# EAGLE design LT8335_6V (EAGLE 8.3.2)
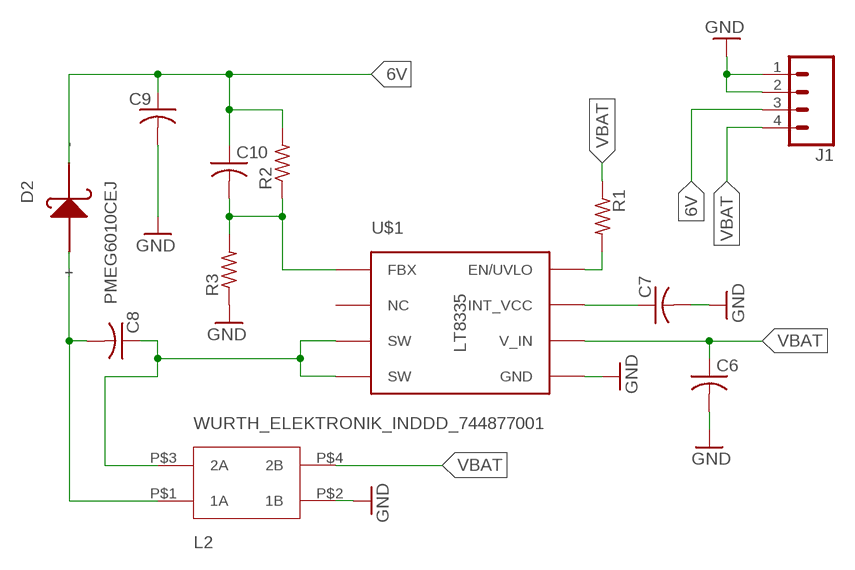
[diagram p0: schematic, sheet 1]

## Parts
C6  C-USC0805  [C0805]
C7  C-USC0805  [C0805]
C8  C-USC0805  [C0805]
C9  C-USC0805  [C0805]
C10  C-USC0805  [C0805]
D2  PMEG6010CEJ  [SC-90]
J1  CONN_04LOCK  [1X04_LOCK]
L2  WURTH_ELEKTRONIK_INDDD_744877001  [WURTH_ELEKTRONIK_INDDD_744877001]
R1  R-US_R0805  [R0805]
R2  R-US_R0805  [R0805]
R3  R-US_R0805  [R0805]
U$1  LT8335  [DDB]

## Nets
6V: C9.1 C10.1 D2.P$2(-) J1.3 R2.2
EN_UVLO1: R1.2 U$1.P$8(EN/UVLO)
FBX1: C10.2 R2.1 R3.2 U$1.P$1(FBX)
GND: C6.2 C7.2 C9.2 J1.1 J1.2 L2.P$2(1B) R3.1 U$1.GND U$1.P$5(GND)
INT_VCC1: C7.1 U$1.P$7(INT_VCC)
N$1: C8.2 D2.P$1(+) L2.P$1(1A)
SW1: C8.1 L2.P$3(2A) U$1.P$3(SW) U$1.P$4(SW)
VBAT: C6.1 J1.4 L2.P$4(2B) R1.1 U$1.P$6(V_IN)
Unconnected: U$1.P$2(NC)

## Library data of the parts
C6-C10 = rcl:C-US: CAPACITOR, American symbol
D2 = DubSat1 Components:PMEG6010CEJ
J1 = SparkFun-Connectors:CONN_04: Multi connection point. Often used as Generic Header-pin footprint for 0.1 inch spaced/style header connections On any of the 0.1 inch spaced packages, you can populate with these: Break Away Headers - Straight <https://www.sparkfun.com/products/116> (PRT-00116) Break Away Male Headers - Right Angle <https://www.sparkfun.com/products/553> (PRT-00553) Female Headers <https://www.sparkfun.com/products/115> (PRT-00115) Break Away Headers - Machine Pin <https://www.sparkfun.com/products/117> (PRT-00117) Break Away Female Headers - Swiss Machine Pin <https://www.sparkfun.com/products/743> (PRT-00743) For SCREWTERMINALS and SPRING TERMINALS visit here: Screw Terimnals on SparkFun.com <https://www.sparkfun.com/search/results?term=Screw+Terminals> (5mm/3.5mm/2.54mm spacing) This device is also useful as a general connection point to wire up your design to another part of your project. Our various solder wires solder well into these plated through hole pads. Hook-Up Wire - Assortment (Stranded, 22 AWG) <https://www.sparkfun.com/products/11375> (PRT-11375) Hook-Up Wire - Assortment (Solid Core, 22 AWG) <https://www.sparkfun.com/products/11367> (PRT-11367) View the entire wire category on our website here <https://www.sparkfun.com/categories/141> Special notes: Molex polarized connector foot print use with SKU : PRT-08231 with associated crimp pins and housings. 1MM SMD Version SKU: PRT-10208; PROD_ID: CONN-09696
L2 = DubSat1 Components:WURTH_ELEKTRONIK_INDDD_744877001
R1-R3 = rcl:R-US_: RESISTOR, American symbol
U$1 = DubSat1 Components:LT8335

## Net classes
0 default: width 0.254 mm, drill 0.254 mm, clearance 0.152 mm

## Board
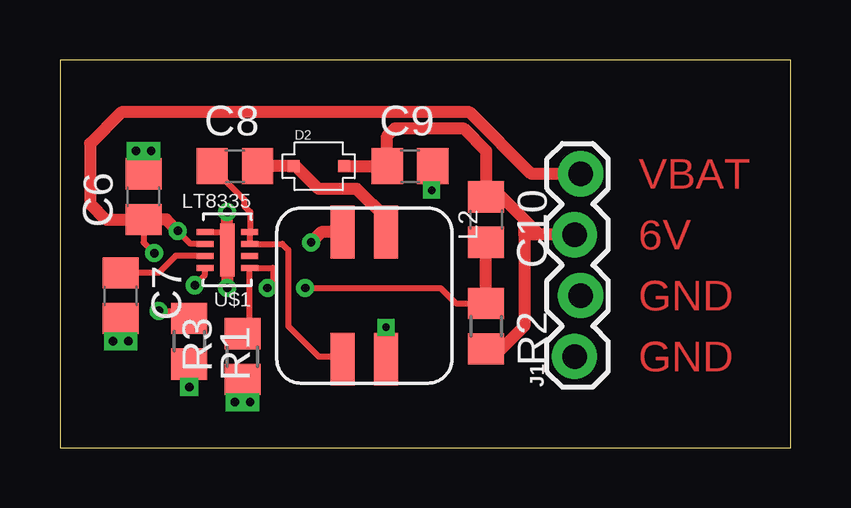
[diagram p1: board, top side]
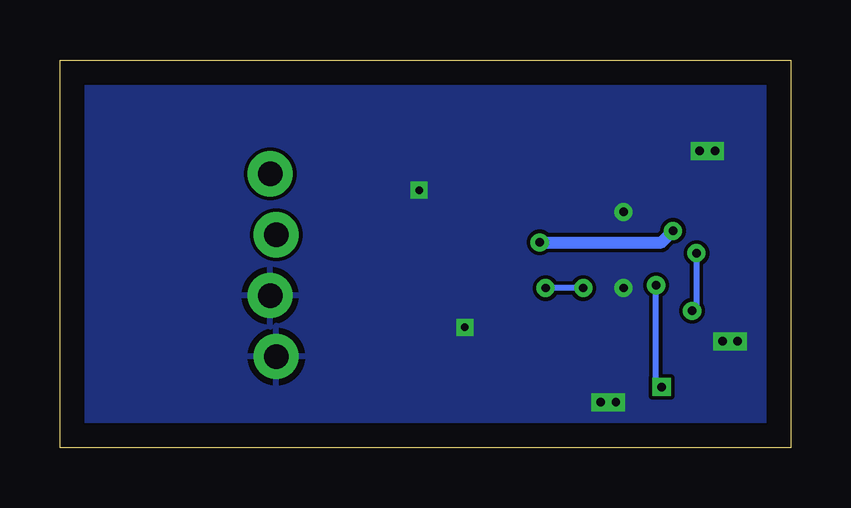
[diagram p2: board, bottom side, seen from below]

Size 30.47 x 16.18 mm. Coordinates in mm from the lower left corner, seen from the top.
Outline: 30.47,0 30.47,16.18 0,16.18 0,0 30.47,0
Copper layers (1*16): Top 0.035mm / dielectric 1.5mm / Bottom 0.035mm
Design rules "default": minimum track width 6mil, minimum drill 0.35mm, track to track 6mil, track to pad 6mil, pad to pad 6mil, via to via 6mil, smd to smd 6mil, copper to edge 40mil, drill to drill 6mil, minimum pad ring 10mil, minimum via ring 8mil, stop-mask expansion 4mil, vias tented up to drill 0mil, thermal gap 10mil

### Footprints (pad centres in the part's own frame; a part is rotated, then mirrored left to right if it is on the bottom)
C0805 = smd 1.3 x 1.5: 1 -0.95,0; 2 0.95,0
SC-90 = smd 0.5 x 0.5: P$1 -1.05,0; P$2 1.05,0
1X04_LOCK = drill 1.016 pad 1.88: 1 0,0.127; 2 2.54,-0.127; 3 5.08,0.127; 4 7.62,-0.127
WURTH_ELEKTRONIK_INDDD_744877001 = smd 1 x 2.2: P$1 -0.9,-2.65; P$2 -0.9,2.65; P$3 0.9,2.65; P$4 0.9,-2.65
R0805 = smd 1.3 x 1.5: 1 -0.95,0; 2 0.95,0
DDB = smd 0.61 x 2.2: GND 0,0 | smd 0.7 x 0.25: P$1 -0.925,0.75; P$2 -0.925,0.25; P$3 -0.925,-0.25; P$4 -0.925,-0.75; P$5 0.925,-0.75; P$6 0.925,-0.25; P$7 0.925,0.25; P$8 0.925,0.75

### Placement (x,y rotation side)
C6  3.48,10.48 90 top
C7  2.53,6.35 270 top
C8  7.29,11.75 0 top
C9  14.6,11.75 0 top
C10  17.77,9.53 270 top
D2  10.79,11.75 0 top
J1  21.58,3.81 90 top
L2  12.69,6.35 180 top
R1  5.39,4.45 270 top
R2  17.77,5.08 270 top
R3  7.61,3.81 90 top
U$1  6.98,8.25 180 top

### Tracks (layer width: path | path; a pad name or v marks a point on that pad's centre or on a via)
6V
  Top 0.508: D2.P$2 C9.1 13.65,13.02 13.96,13.34 16.82,13.34 17.77,12.38 C10.1 18.41,10.47 19.36,9.53 | 19.36,8.89 19.36,9.53 | 19.36,8.89 19.36,5.08 18.41,4.13 R2.2 | J1.3 20.31,8.89 19.99,8.89 | 19.99,8.89 19.36,9.53 | 19.99,8.89 19.36,8.89
EN_UVLO1  (via drill 0.35)
  Top 0.254: R1.2 v5.39,2.54 | v5.62,6.78 6.05,7.22 U$1.P$8
  Bottom 0.254: v5.39,2.54 5.62,2.77 v5.62,6.78
FBX1  (via drill 0.35)
  Top 0.254: R3.2 7.9,5.05 U$1.P$1 8.88,7.5 8.88,6.9 v8.65,6.67 | v10.22,6.67 15.87,6.67 16.5,6.03 R2.1
  Top 0.508: C10.2 R2.1
  Bottom 0.254: v8.65,6.67 v10.22,6.67
GND  (via drill 0.3, 0.35)
  Top 0.254: U$1.P$5 6.86,9 6.98,8.89 U$1.GND | L2.P$2 v13.59,5.03 | v7.29,1.91 7.61,2.22 | v7.93,1.91 7.61,2.22 | 7.61,2.22 R3.1 | v3.17,12.38 3.17,11.75 C6.2 3.8,11.75 v3.8,12.38 | v2.85,4.45 2.85,5.08 2.69,5.24 | 2.69,5.24 C7.2 | v2.21,4.45 2.21,4.76 2.69,5.24
  Top 0.508: v6.98,6.67 U$1.GND v6.98,9.84 | v15.5,10.74 15.5,11.7 C9.2
  pour Bottom: -0.01,0 -0.01,16.51 30.47,16.51 30.47,0
INT_VCC1
  Top 0.254: U$1.P$7 4.82,8 4.12,7.3 C7.1
N$1
  Top 0.508: C8.2 D2.P$1 9.83,11.75 10.79,10.8 12.37,10.8 13.59,9.58 L2.P$1
SW1
  Top 0.254: L2.P$3 11.68,3.81 10.79,3.81 9.52,5.08 9.52,8.25 9.27,8.5 U$1.P$3 U$1.P$4 7.93,9.03 7.93,9.84 7.68,10.09 7.68,10.36 6.34,11.7 C8.1
VBAT  (via drill 0.35)
  Top 0.254: U$1.P$6 5.46,8.5 v4.91,9.05 | R1.1 5.39,5.71 | R1.1 | C6.1 3.48,8.57 v3.93,8.12 | v4.12,5.71 5.07,5.71 R1.1
  Top 0.508: v4.91,9.05 4.43,9.53 C6.1 1.89,9.53 1.26,10.16 1.26,12.7 2.55,14 17.09,14 19.66,11.43 J1.4 | L2.P$4 10.9,9 v10.47,8.57
  Bottom 0.254: v3.93,8.12 3.93,5.9 v4.12,5.71
  Bottom 0.508: v10.47,8.57 5.39,8.57 v4.91,9.05

### Text on the board
Top: VBAT | 6V | GND | GND